# EAGLE design ihc_mon (EAGLE 9.6.2)
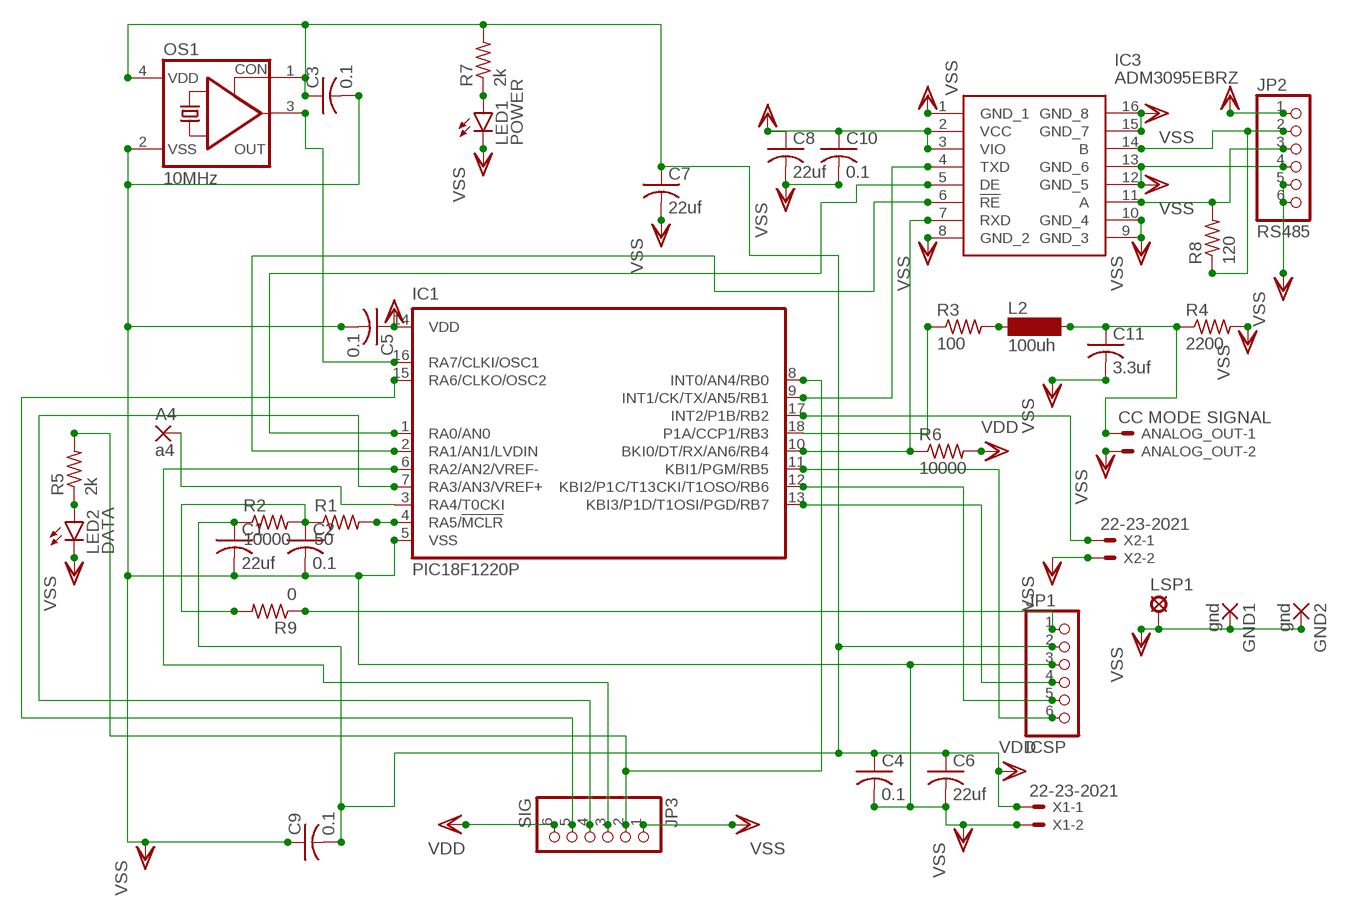
[diagram p0: schematic, sheet 1]

## Parts
A4  a4  SMD2  [SMD1,27-2,54]
ANALOG_OUT  CC MODE SIGNAL  22-23-2021  [22-23-2021]
C1  22uf  C-USC0805  [C0805]
C2  0.1  C-USC0805  [C0805]
C3  0.1  C-USC0805  [C0805]
C4  0.1  C-USC0805  [C0805]
C5  0.1  C-USC0805  [C0805]
C6  22uf  C-USC0805  [C0805]
C7  22uf  C-USC0805  [C0805]
C8  22uf  C-USC0805  [C0805]
C9  0.1  C-USC0805  [C0805]
C10  0.1  C-USC0805  [C0805]
C11  3.3uf  C-USC0805  [C0805]
GND1  gnd  3,81/1,4  [3,81/1,4]
GND2  gnd  SMD2  [SMD1,27-2,54]
IC1  PIC18F1220P  [DIL18]
IC3  ADM3095EBRZ  [SOIC127P600X175-16N]
JP1  ICSP  PINHD-1X6  [1X06]
JP2  RS485  PINHD-1X6  [1X06]
JP3  SIG  PINHD-1X6  [1X06]
L2  100uh  SM-1206  [SM-1206]
LED1  POWER  LEDCHIPLED_1206  [CHIPLED_1206]
LED2  DATA  LEDCHIPLED_1206  [CHIPLED_1206]
LSP1  SE14  [SE14]
OS1  10MHz  OSC-OE-CFPS-32  [7.2X5.2-4-PAD]
R1  50  R-US_R0805  [R0805]
R2  10000  R-US_R0805  [R0805]
R3  100  R-US_R0805  [R0805]
R4  2200  R-US_R0805  [R0805]
R5  2k  R-US_R0805  [R0805]
R6  10000  R-US_R0805  [R0805]
R7  2k  R-US_R0805  [R0805]
R8  120  R-US_M1206  [M1206]
R9  0  R-US_R0805  [R0805]
X1  22-23-2021  [22-23-2021]
X2  22-23-2021  [22-23-2021]

## Nets
N$1: IC1.10(BKI0/DT/RX/AN6/RB4) IC3.7(RXD) R6.1
N$2: IC1.9(INT1/CK/TX/AN5/RB1) IC3.4(TXD)
N$3: IC1.1(RA0/AN0) IC3.5(DE)
N$4: IC1.2(RA1/AN1/LVDIN) IC3.6(!RE)
N$5: IC1.4(RA5/!MCLR) R1.2
N$6: IC1.18(P1A/CCP1/RB3) R3.1
N$7: L2.1 R3.2
N$8: IC3.14(B) JP2.2 R8.1
N$9: IC3.11(A) JP2.3 R8.2
N$10: IC1.17(INT2/P1B/RB2) X2.1
N$11: ANALOG_OUT.1 C11.1 L2.2 R4.1
N$12: JP1.1 R9.1
N$13: LED2.A R5.1
N$14: LED1.A R7.1
N$15: IC1.11(KBI1/PGM/RB5) JP1.6
N$16: A4.1(P) IC1.3(RA4/T0CKI)
N$17: IC1.8(INT0/AN4/RB0) JP3.2 R5.2
N$18: IC1.6(RA2/AN2/VREF-) JP3.3
N$20: IC1.12(KBI2/P1C/T13CKI/T1OSO/RB6) JP1.5
N$21: IC1.13(KBI3/P1D/T1OSI/PGD/RB7) JP1.4
N$23: C2.1 R1.1 R2.2 R9.2
N$25: IC1.16(RA7/CLKI/OSC1) OS1.3(OUT)
SIG4: IC1.7(RA3/AN3/VREF+) JP3.4
SIG5: IC1.15(RA6/CLKO/OSC2) JP3.5
VDD [i-current]: C1.1 C3.1 C4.1 C5.1 C6.1 C7.1 C8.1 C9.2 C10.1 IC1.14(VDD) IC3.2(VCC) IC3.3(VIO) JP1.2 JP2.1 JP3.6 OS1.1(CON) OS1.4(VDD) R2.1 R6.2 R7.2 X1.1
VSS [i-current]: ANALOG_OUT.2 C1.2 C2.2 C3.2 C4.2 C5.2 C6.2 C7.2 C8.2 C9.1 C10.2 C11.2 GND1.1(P) GND2.1(P) IC1.5(VSS) IC3.1(GND_1) IC3.8(GND_2) IC3.9(GND_3) IC3.10(GND_4) IC3.12(GND_5) IC3.13(GND_6) IC3.15(GND_7) IC3.16(GND_8) JP1.3 JP2.4 JP2.5 JP2.6 JP3.1 LED1.C LED2.C LSP1.MP OS1.2(VSS) R4.2 X1.2 X2.2

## Library data of the parts
A4 GND2 = wirepad:SMD2: SMD PAD
ANALOG_OUT X1 X2 = con-molex:22-23-2021: .100" (2.54mm) Center Header - 2 Pin; MF: MOLEX; MPN: 22-23-2021; OC_FARNELL: 1462926; OC_NEWARK: 25C3832
C1-C11 = rcl:C-US: CAPACITOR, American symbol; SPICEPREFIX: C
GND1 = wirepad:3,81/1,4: THROUGH-HOLE PAD
IC1 = microchip:PIC18F1*20: 18/20/28-Pin High-Performance, Enhanced Flash Microcontrollers with 10-bit A/D and nanoWatt Technology Source: ww1.microchip.com/downloads/en/DeviceDoc/39605c.pdf; MF: MICROCHIP; MPN: PIC18F1320-I/P; OC_FARNELL: 9761977; OC_NEWARK: 92C2429
IC3 = SamacSys_Parts:ADM3095EBRZ: Level 4 EMC Protected RS-485 Transceiver with Full +/-42 V Fault Protection Source: Datasheet <https://componentsearchengine.com/Datasheets/1/ADM3095EBRZ.pdf>; DESCRIPTION: Level 4 EMC Protected RS-485 Transceiver with Full +/-42 V Fault Protection; HEIGHT: 1.75mm; MANUFACTURER_NAME: Analog Devices; MANUFACTURER_PART_NUMBER: ADM3095EBRZ; MOUSER_PART_NUMBER: 584-ADM3095EBRZ; MOUSER_PRICE-STOCK: https://www.mouser.com/Search/Refine.aspx?Keyword=584-ADM3095EBRZ
JP1-JP3 = pinhead:PINHD-1X6: PIN HEADER
L2 = inductor-neosid:SM-1206: INDUCTOR SMD chip inductor; OC_FARNELL: unknown; OC_NEWARK: unknown
LED1 LED2 = led:LED: LED OSRAM: - CHIPLED LG R971, LG N971, LY N971, LG Q971, LY Q971, LO R971, LY R971 LH N974, LH R974 LS Q976, LO Q976, LY Q976 LO Q996 - Hyper CHIPLED LW Q18S LB Q993, LB Q99A, LB R99A - SideLED LS A670, LO A670, LY A670, LG A670, LP A670 LB A673, LV A673, LT A673, LW A673 LH A674 LY A675 LS A676, LA A676, LO A676, LY A676, LW A676 LS A679, LY A679, LG A679 - Hyper Micro SIDELED® LS Y876, LA Y876, LO Y876, LY Y876 LT Y87S - SmartLED LW L88C, LW L88S LB L89C, LB L89S, LG L890 LS L89K, LO L89K, LY L89K LS L896, LA L896, LO L896, LY L896 - TOPLED LS T670, LO T670, LY T670, LG T670, LP T670 LSG T670, LSP T670, LSY T670, LOP T670, LYG T670 LG T671, LOG T671, LSG T671 LB T673, LV T673, LT T673, LW T673 LH T674 LS T676, LA T676, LO T676, LY T676, LB T676, LH T676, LSB T676, LW T676 LB T67C, LV T67C, LT T67C, LS T67K, LO T67K, LY T67K, LW E67C LS E67B, LA E67B, LO E67B, LY E67B, LB E67C, LV E67C, LT E67C LW T67C LS T679, LY T679, LG T679 LS T770, LO T770, LY T770, LG T770, LP T770 LB T773, LV T773, LT T773, LW T773 LH T774 LS E675, LA E675, LY E675, LS T675 LS T776, LA T776, LO T776, LY T776, LB T776 LHGB T686 LT T68C, LB T68C - Hyper Mini TOPLED® LB M676 - Mini TOPLED Santana® LG M470 LS M47K, LO M47K, LY M47K Source: http://www.osram.convergy.de LUXEON: - LUMILED® LXK2-PW12-R00, LXK2-PW12-S00, LXK2-PW14-U00, LXK2-PW14-V00 LXK2-PM12-R00, LXK2-PM12-S00, LXK2-PM14-U00 LXK2-PE12-Q00, LXK2-PE12-R00, LXK2-PE12-S00, LXK2-PE14-T00, LXK2-PE14-U00 LXK2-PB12-K00, LXK2-PB12-L00, LXK2-PB12-M00, LXK2-PB14-N00, LXK2-PB14-P00, LXK2-PB14-Q00 LXK2-PR12-L00, LXK2-PR12-M00, LXK2-PR14-Q00, LXK2-PR14-R00 LXK2-PD12-Q00, LXK2-PD12-R00, LXK2-PD12-S00 LXK2-PH12-R00, LXK2-PH12-S00 LXK2-PL12-P00, LXK2-PL12-Q00, LXK2-PL12-R00 Source: www.luxeon.com KINGBRIGHT: KA-3528ASYC Source: www.kingbright.com
LSP1 = solpad:SE14: SOLDER PAD E1553, drill 1,4mm, distributor Buerklin, 07F820
OS1 = IQD-Frequency-Products:OSC-OE: OSCILLATOR WITH OE
R1-R9 = rcl:R-US_: RESISTOR, American symbol; SPICEPREFIX: R

## Net classes
1 i-current: width 0.127 mm

## Board
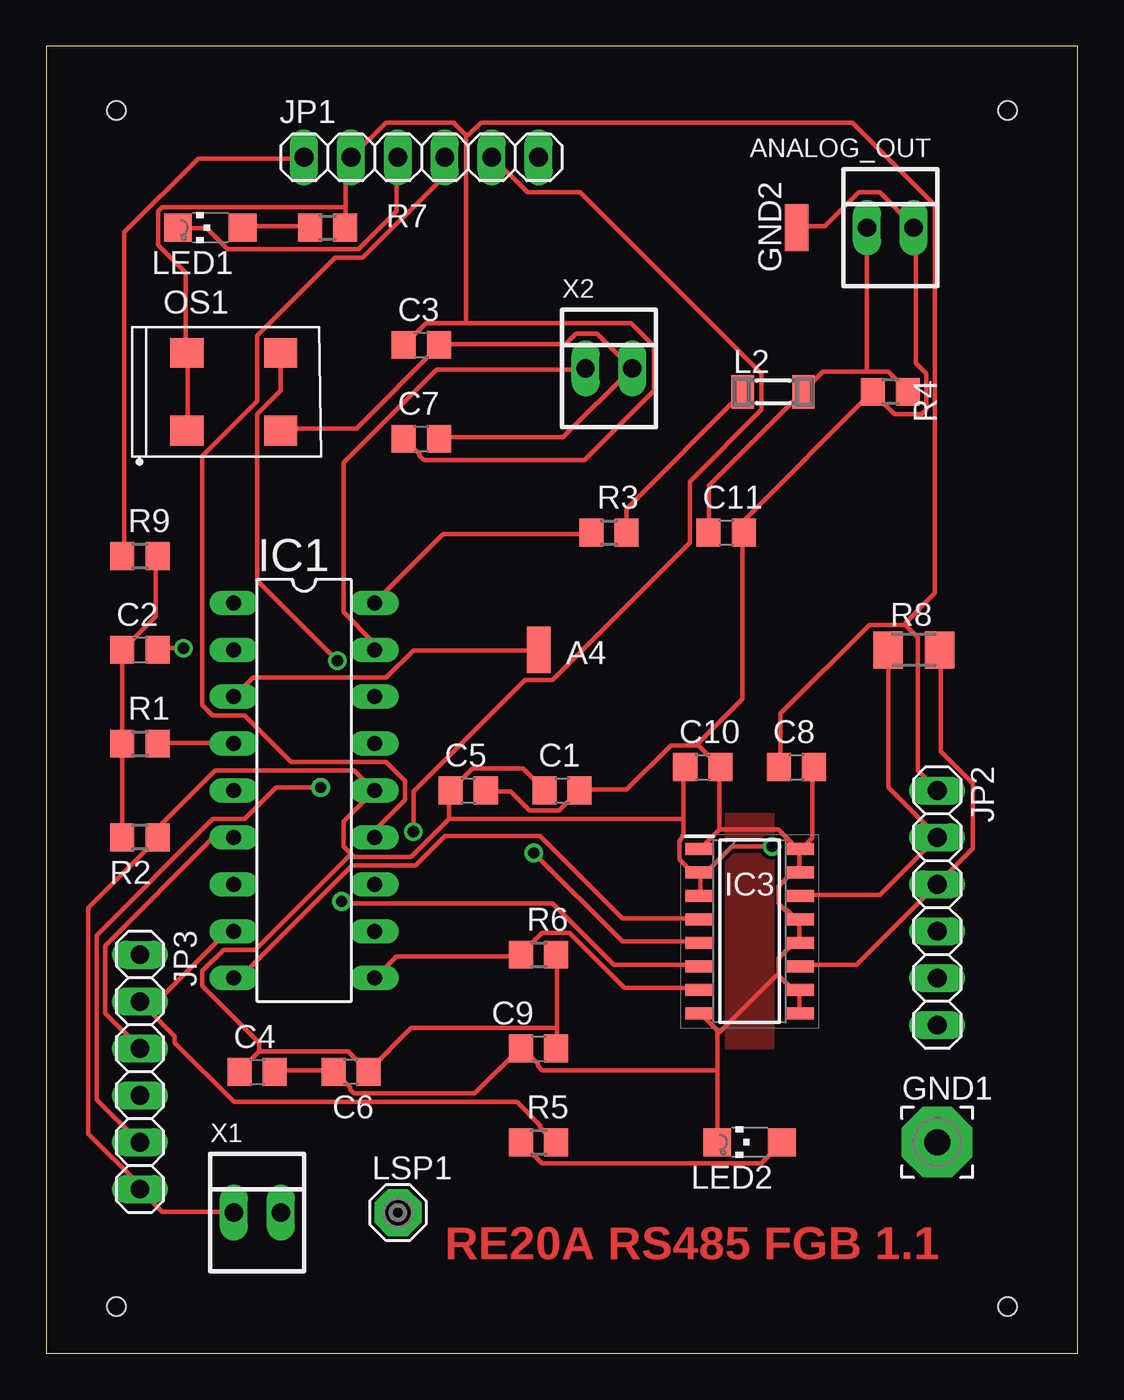
[diagram p1: board, top side]
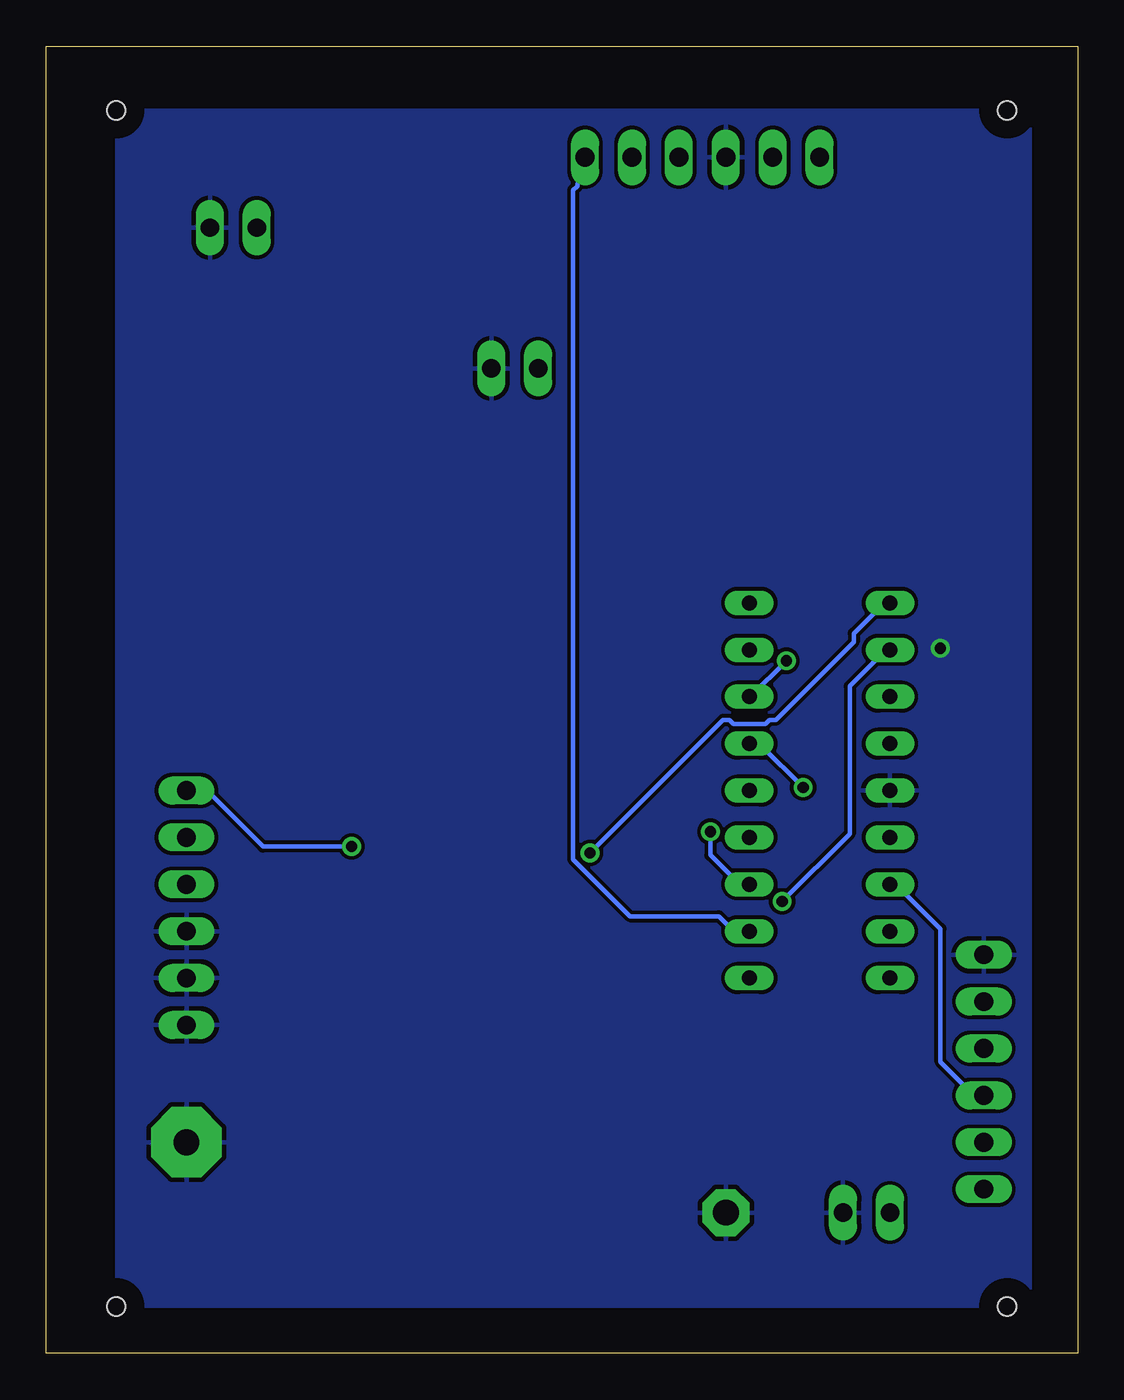
[diagram p2: board, bottom side, seen from below]

Size 55.86 x 70.79 mm. Coordinates in mm from the lower left corner, seen from the top.
Outline: 0,0 55.86,0 55.86,70.79 0,70.79 0,0
Copper layers (1*16): Top 0.035mm / dielectric 1.5mm / Bottom 0.035mm
Design rules "default": minimum track width 10mil, minimum drill 24mil, track to track 8mil, track to pad 8mil, pad to pad 8mil, via to via 8mil, smd to smd 8mil, copper to edge 40mil, drill to drill 8mil, minimum pad ring 10mil, minimum via ring 8mil, stop-mask expansion 4mil, vias tented up to drill 0mil, thermal gap 10mil
Holes 1 mm at 3.81,67.31 52.07,67.31 52.07,2.54 3.81,2.54

### Footprints (pad centres in the part's own frame; a part is rotated, then mirrored left to right if it is on the bottom)
SMD1,27-2,54 = smd 1.27 x 2.54: 1 0,0
22-23-2021 = drill 1 long: 1 -1.27,0; 2 1.27,0
C0805 = smd 1.3 x 1.5: 1 -0.95,0; 2 0.95,0
3,81/1,4 = drill 1.397 pad 3.81 octagon: 1 0,0
DIL18 = drill 0.813 long: 1 -10.16,-3.81; 2 -7.62,-3.81; 3 -5.08,-3.81; 4 -2.54,-3.81; 5 0,-3.81; 6 2.54,-3.81; 7 5.08,-3.81; 8 7.62,-3.81; 9 10.16,-3.81; 10 10.16,3.81; 11 7.62,3.81; 12 5.08,3.81; 13 2.54,3.81; 14 0,3.81; 15 -2.54,3.81; 16 -5.08,3.81; 17 -7.62,3.81; 18 -10.16,3.81
SOIC127P600X175-16N = smd 1.525 x 0.65: 1 -2.712,4.445; 2 -2.712,3.175; 3 -2.712,1.905; 4 -2.712,0.635; 5 -2.712,-0.635; 6 -2.712,-1.905; 7 -2.712,-3.175; 8 -2.712,-4.445; 9 2.712,-4.445; 10 2.712,-3.175; 11 2.712,-1.905; 12 2.712,-0.635; 13 2.712,0.635; 14 2.712,1.905; 15 2.712,3.175; 16 2.712,4.445
1X06 = drill 1.016 long: 1 -6.35,0; 2 -3.81,0; 3 -1.27,0; 4 1.27,0; 5 3.81,0; 6 6.35,0
SM-1206 = smd 1.2 x 1.8: 1 -1.65,0; 2 1.65,0
CHIPLED_1206 = smd 1.5 x 1.5: A 0,-1.75; C 0,1.75
SE14 = drill 1.397 pad 2.54 octagon: MP 0,0
7.2X5.2-4-PAD = smd 1.8 x 1.6: 1 -2.54,-2.1; 2 2.54,-2.1; 3 2.54,2.1; 4 -2.54,2.1
R0805 = smd 1.3 x 1.5: 1 -0.95,0; 2 0.95,0
M1206 = smd 1.6 x 2: 1 -1.4,0; 2 1.4,0

### Placement (x,y rotation side)
A4  26.67,38.1 0 top
ANALOG_OUT  45.72,60.96 0 top
C1  27.94,30.48 0 top
C2  5.08,38.1 0 top
C3  20.32,54.61 0 top
C4  11.43,15.24 0 top
C5  22.86,30.48 0 top
C6  16.51,15.24 180 top
C7  20.32,49.53 0 top
C8  40.64,31.75 0 top
C9  26.67,16.51 0 top
C10  35.56,31.75 0 top
C11  36.83,44.45 0 top
GND1  48.26,11.43 0 top
GND2  40.64,60.96 0 top
IC1  13.97,30.48 270 top
IC3  38.1,22.86 0 top
JP1  20.32,64.77 0 top
JP2  48.26,24.13 270 top
JP3  5.08,15.24 270 top
L2  39.37,52.07 0 top
LED1  8.89,60.96 90 top
LED2  38.1,11.43 90 top
LSP1  19.05,7.62 0 top
OS1  10.16,52.07 0 top
R1  5.08,33.02 0 top
R2  5.08,27.94 180 top
R3  30.48,44.45 0 top
R4  45.72,52.07 180 top
R5  26.67,11.43 0 top
R6  26.67,21.59 0 top
R7  15.24,60.96 0 top
R8  46.99,38.1 0 top
R9  5.08,43.18 0 top
X1  11.43,7.62 0 top
X2  30.48,53.34 0 top

### Tracks (layer width: path | path; a pad name or v marks a point on that pad's centre or on a via)
N$1
  Top 0.254: IC1.10 17.83,20.36 18.97,21.5 25.72,21.5 R6.1 25.72,21.61 26.86,22.76 28.35,22.76 31.32,19.79 35.32,19.79 IC3.7
N$2
  Top 0.254: IC3.4 35.32,23.56 31.2,23.56 26.75,28.02 21.6,28.02 20,26.42 16.57,26.42 10.52,20.36 10.17,20.36 IC1.9
N$3  (via drill 0.61)
  Top 0.254: v26.4,27.1 31.2,22.3 35.32,22.3 IC3.5
  Bottom 0.254: v26.4,27.1 19.2,34.3 18.86,34.3 18.63,34.07 16.92,34.07 16.69,34.3 16.34,34.3 12.12,38.53 12.12,38.99 10.52,40.59 10.17,40.59 IC1.1
N$4  (via drill 0.61)
  Top 0.254: v16,24.47 16.12,24.36 27.43,24.36 30.75,21.04 35.32,21.04 IC3.6
  Bottom 0.254: v16,24.47 12.34,28.13 12.34,36.13 10.4,38.08 10.17,38.08 IC1.2
N$5
  Top 0.254: R1.2 6.06,33.05 10.06,33.05 IC1.4
N$6
  Top 0.254: R3.1 29.49,44.36 21.49,44.36 17.83,40.7 IC1.18
N$7
  Top 0.254: R3.2 31.43,44.47 31.43,45.73 37.72,52.02 L2.1
N$8
  Top 0.254: IC3.14 40.92,24.82 45.15,24.82 48.23,27.9 JP2.2 48.23,28.02 45.61,30.64 45.61,38.08 R8.1
N$9
  Top 0.254: IC3.11 40.92,21.04 43.89,21.04 48.23,25.39 JP2.3 48.35,25.5 50.18,27.33 50.18,30.87 48.46,32.59 48.46,38.08 R8.2
N$10
  Top 0.254: IC1.17 17.72,38.19 17.72,38.53 16.12,40.13 16.12,48.25 21.14,53.28 29.15,53.28 X2.1
N$11
  Top 0.254: C11.1 35.89,44.47 35.89,46.99 40.92,52.02 L2.2 41.03,52.13 42.06,53.16 44.46,53.16 | 44.46,53.16 45.61,53.16 46.63,52.13 R4.1 | 44.46,53.16 44.46,60.94 ANALOG_OUT.1
N$12
  Top 0.254: R9.1 4.23,43.22 4.23,60.71 8.23,64.71 13.95,64.71 JP1.1
N$13
  Top 0.254: R5.1 25.83,11.33 26.86,10.3 38.75,10.3 39.78,11.33 LED2.A
N$14
  Top 0.254: LED1.A 10.74,61.05 14.29,61.05 R7.1
N$15
  Bottom 0.254: IC1.11 17.83,22.87 18.63,22.87 19.43,23.67 24.23,23.67 27.32,26.76 27.32,62.99 27.09,63.22 27.09,63.34 26.75,63.68 26.75,64.71 JP1.6
N$16
  Top 0.254: A4.1 26.63,38.08 19.89,38.08 18.4,36.59 11.2,36.59 10.17,35.56 IC1.3
N$17
  Top 0.254: R5.2 27.55,11.44 26.75,12.24 26.75,12.36 25.49,13.61 10.17,13.61 6.97,16.82 6.97,17.16 JP3.2 5.6,18.64 9.72,22.76 10.06,22.76 IC1.8
N$18
  Top 0.254: IC1.6 10.06,27.9 9.03,27.9 3.2,22.07 3.2,18.41 5.03,16.59 JP3.3
N$20  (via drill 0.61)
  Top 0.254: v19.89,28.25 19.89,30.42 25.95,36.47 27.43,36.47 34.86,43.9 34.86,47.22 38.75,51.11 38.75,53.05 28.92,62.88 26.06,62.88 24.23,64.71 JP1.5
  Bottom 0.254: v19.89,28.25 19.89,26.99 18.4,25.5 17.83,25.5 IC1.12
N$21
  Top 0.254: IC1.13 17.83,28.02 17.83,28.36 19.43,29.96 19.43,30.99 18.4,32.02 13.26,32.02 10.74,34.53 9.03,34.53 8.46,35.1 8.46,48.59 11.43,51.56 11.43,55.11 15.66,59.33 17.14,59.33 21.49,63.68 21.49,64.71 JP1.4
N$23
  Top 0.254: R2.2 4.12,28.02 4.12,32.93 R1.1 4.12,33.05 4.12,38.08 C2.1 4.23,38.19 5.94,39.9 5.94,43.1 R9.2
N$25  (via drill 0.61)
  Top 0.254: v15.77,37.5 11.43,41.85 11.43,50.88 12.69,52.13 12.69,54.08 OS1.3
  Bottom 0.254: v15.77,37.5 17.72,35.56 IC1.16
SIG4
  Bottom 0.254: IC1.7 10.06,25.39 9.83,25.39 7.43,22.99 7.43,15.79 5.71,14.07 5.14,14.07 JP3.4
SIG5  (via drill 0.61)
  Top 0.254: v14.86,30.64 12.46,30.64 10.74,28.93 9.03,28.93 2.74,22.64 2.74,13.73 5.03,11.44 JP3.5
  Bottom 0.254: v14.86,30.64 17.14,32.93 17.72,32.93 IC1.15
VDD  (via drill 0.61)
  Top 0.254: 22.75,55.79 20.57,55.79 19.43,54.65 C3.1 | 22.75,55.79 31.66,55.79 32.92,54.53 32.92,52.13 29.15,48.36 20.46,48.36 20.23,48.59 20.23,48.7 19.43,49.5 C7.1 | OS1.1 7.66,50.08 7.66,54.08 OS1.4 7.54,54.19 7.54,58.53 6.06,60.02 6.06,61.85 6.29,62.08 16.23,62.08 | 16.23,62.08 16.23,64.48 16.46,64.71 JP1.2 16.57,64.82 18.4,66.65 22.06,66.65 22.75,65.96 | 16.23,62.08 16.23,61.05 R7.2 | 22.75,65.96 22.75,55.79 | 27.66,17.61 27.66,21.5 R6.2 | 27.66,17.61 27.66,16.59 C9.2 | 11.54,16.36 10.52,15.33 C4.1 | 11.54,16.36 16.34,16.36 17.37,15.33 C6.1 17.49,15.33 19.77,17.61 27.66,17.61 | 46.52,39.45 44.58,39.45 39.78,34.65 39.78,31.79 C8.1 | 46.52,39.45 47.21,38.76 47.21,31.56 48.23,30.53 JP2.1 | X1.1 10.06,7.67 6.29,7.67 5.14,8.81 JP3.6 5.03,8.93 5.03,9.16 2.29,11.9 2.29,24.13 6.06,27.9 R2.1 6.06,28.02 6.06,28.47 9.14,31.56 16.69,31.56 17.72,30.53 IC1.14 16.12,28.82 16.12,27.44 16.52,27.04 | 34.52,28.93 34.52,28.02 34.29,27.79 34.29,26.76 34.98,26.07 35.32,26.07 IC3.2 | 34.52,28.93 34.52,31.67 C10.1 | IC3.3 35.43,24.82 35.43,25.96 IC3.2 | C1.1 26.98,30.53 25.83,31.67 23.09,31.67 21.95,30.53 C5.1 21.83,30.42 21.83,28.93 | 21.83,28.93 19.77,26.87 16.69,26.87 16.52,27.04 | 21.83,28.93 34.52,28.93 | v39.32,27.44 37.15,27.44 35.55,25.85 IC3.2 | 11.54,16.36 11.54,16.82 8.46,19.9 8.46,20.7 9.6,21.84 11.32,21.84 16.52,27.04 | 22.75,65.96 22.86,65.96 23.55,66.65 43.66,66.65 48.12,62.19 48.12,41.16 46.52,39.56 46.52,39.45
  Bottom 0.254: v39.32,27.44 44.12,27.44 47.09,30.42 48.23,30.42 JP2.1
VSS  (via drill 0.61)
  Top 0.254: OS1.2 12.8,50.08 16.8,50.08 21.26,54.53 C3.2 21.37,54.65 28.12,54.65 28.69,55.22 29.83,55.22 31.66,53.39 X2.2 31.66,53.28 28,49.62 21.37,49.62 C7.2 | v7.43,38.19 6.06,38.19 C2.2 | LED1.C 7.2,60.94 8.69,60.94 9.83,59.79 16.92,59.79 18.97,61.85 18.97,64.71 JP1.3 | GND2.1 40.69,61.05 42.18,61.05 44.01,62.88 45.15,62.88 46.98,61.05 ANALOG_OUT.2 47.09,60.94 47.09,53.62 47.66,53.05 47.66,51.11 47.43,50.88 45.95,50.88 44.81,52.02 R4.2 44.69,52.02 37.83,45.16 37.83,44.47 C11.2 37.72,44.36 37.72,35.45 35.32,33.05 35.32,32.93 | C5.2 23.89,30.42 25.15,30.42 26.18,29.39 27.77,29.39 28.8,30.42 C1.2 28.92,30.53 31.43,30.53 33.83,32.93 35.32,32.93 | 36.46,28.36 36.46,31.67 C10.2 36.46,31.79 35.32,32.93 | 36.46,28.36 35.43,27.33 IC3.1 | IC3.9 40.8,19.67 IC3.10 40.69,19.67 40.46,19.67 39.66,20.47 | 39.66,20.47 39.66,21.39 40.69,22.42 IC3.12 40.8,22.3 40.8,23.44 IC3.13 40.69,23.44 40.12,24.02 40.01,24.02 39.66,24.36 39.66,25.27 40.69,26.3 IC3.15 40.8,26.07 40.8,27.22 IC3.16 | C8.2 41.49,31.67 41.49,27.9 40.92,27.33 IC3.16 | C4.2 12.46,15.33 15.54,15.33 C6.2 15.66,15.21 16.46,14.41 16.46,14.3 16.69,14.07 23.2,14.07 25.6,16.47 C9.1 25.83,16.47 26.63,15.67 26.63,15.56 26.86,15.33 36.35,15.33 | 36.35,17.39 36.35,17.5 35.43,18.41 IC3.8 | 36.35,17.39 36.35,15.33 | 36.35,15.33 36.35,11.44 LED2.C | 39.66,20.47 39.55,20.47 36.46,17.39 36.35,17.39 | 36.46,28.36 39.66,28.36 40.69,27.33 IC3.16
  pour Bottom: 2.54,67.31 52.07,67.31 52.07,2.54 2.54,2.54
  pour Top: 36.83,29.21 39.37,29.21 39.37,16.51 36.83,16.51

### Text on the board
Top: RE20A RS485 FGB 1.1